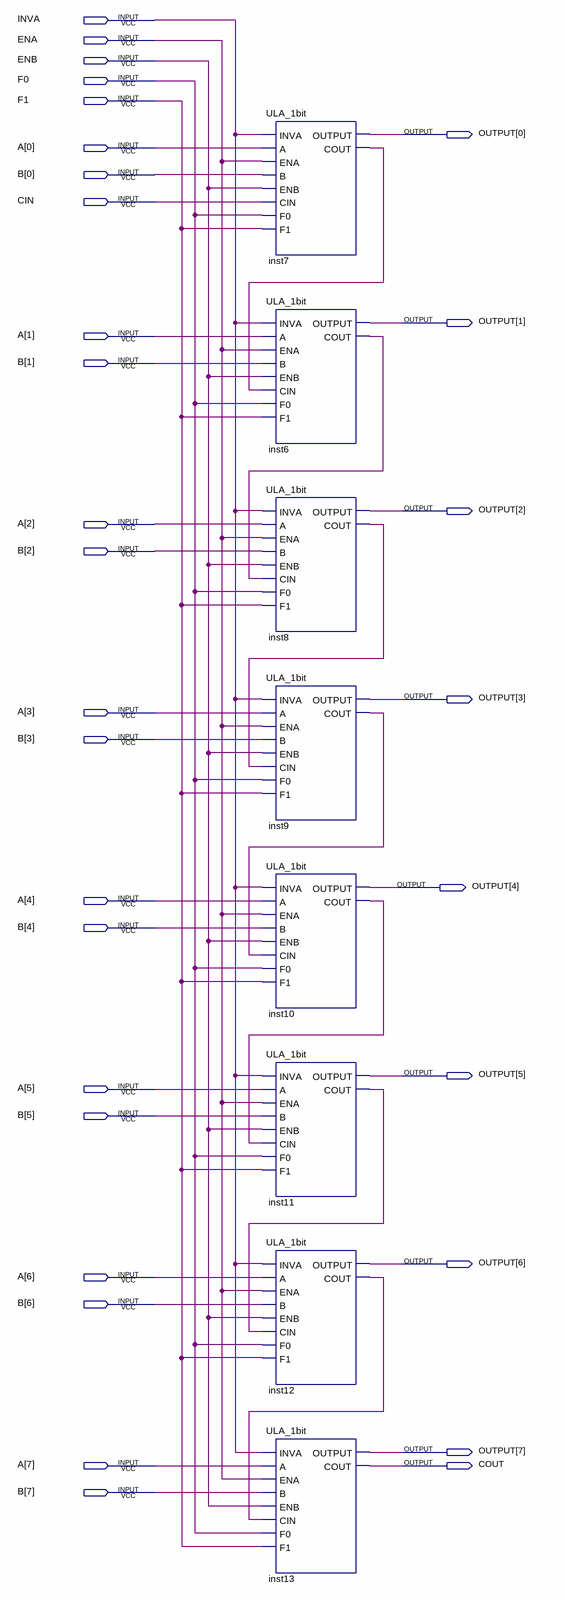
[diagram p0: schematic sheet]
// Quartus schematic ULA_8bit.bdf as structural Verilog: 8 symbols, 31 pins
module ULA_8bit (
  input  INVA,
  input  ENA,
  input  ENB,
  input  F0,
  input  F1,
  input  [7:0] A,
  input  [7:0] B,
  input  CIN,
  output [7:0] OUTPUT,
  output COUT
);

  wire inst6_cout, inst7_cout, inst8_cout, inst9_cout, inst10_cout, inst11_cout, inst12_cout;

  ULA_1bit inst7 (
    .INVA(INVA), .A(A[0]), .ENA(ENA), .B(B[0]), .ENB(ENB), .CIN(CIN), .F0(F0), .F1(F1), .OUTPUT(OUTPUT[0]),
    .COUT(inst7_cout));
  ULA_1bit inst6 (
    .INVA(INVA), .A(A[1]), .ENA(ENA), .B(B[1]), .ENB(ENB), .CIN(inst7_cout), .F0(F0), .F1(F1),
    .OUTPUT(OUTPUT[1]), .COUT(inst6_cout));
  ULA_1bit inst8 (
    .INVA(INVA), .A(A[2]), .ENA(ENA), .B(B[2]), .ENB(ENB), .CIN(inst6_cout), .F0(F0), .F1(F1),
    .OUTPUT(OUTPUT[2]), .COUT(inst8_cout));
  ULA_1bit inst9 (
    .INVA(INVA), .A(A[3]), .ENA(ENA), .B(B[3]), .ENB(ENB), .CIN(inst8_cout), .F0(F0), .F1(F1),
    .OUTPUT(OUTPUT[3]), .COUT(inst9_cout));
  ULA_1bit inst10 (
    .INVA(INVA), .A(A[4]), .ENA(ENA), .B(B[4]), .ENB(ENB), .CIN(inst9_cout), .F0(F0), .F1(F1),
    .OUTPUT(OUTPUT[4]), .COUT(inst10_cout));
  ULA_1bit inst11 (
    .INVA(INVA), .A(A[5]), .ENA(ENA), .B(B[5]), .ENB(ENB), .CIN(inst10_cout), .F0(F0), .F1(F1),
    .OUTPUT(OUTPUT[5]), .COUT(inst11_cout));
  ULA_1bit inst12 (
    .INVA(INVA), .A(A[6]), .ENA(ENA), .B(B[6]), .ENB(ENB), .CIN(inst11_cout), .F0(F0), .F1(F1),
    .OUTPUT(OUTPUT[6]), .COUT(inst12_cout));
  ULA_1bit inst13 (
    .INVA(INVA), .A(A[7]), .ENA(ENA), .B(B[7]), .ENB(ENB), .CIN(inst12_cout), .F0(F0), .F1(F1),
    .OUTPUT(OUTPUT[7]), .COUT(COUT));
endmodule
